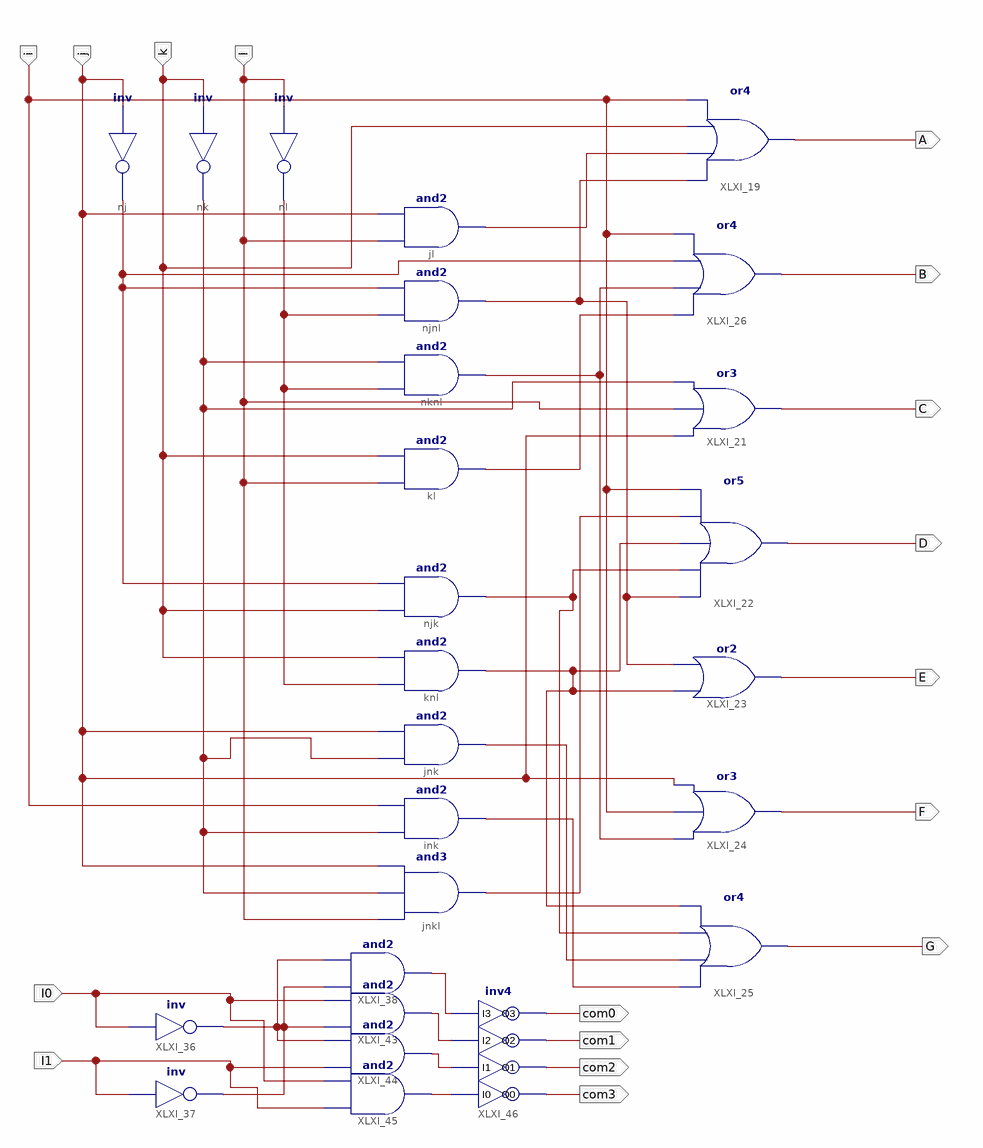
[diagram p0: schematic sheet 1]
// Xilinx ISE schematic BCDto7Seg.sch (spartan6) as structural Verilog: 26 symbols, 17 ports
module BCDto7Seg (
  input  i,
  input  k,
  input  j,
  input  l,
  input  I0,
  input  I1,
  output A,
  output B,
  output C,
  output D,
  output E,
  output F,
  output G,
  output com0,
  output com1,
  output com2,
  output com3
);

  wire XLXN_8, XLXN_52, XLXN_55, XLXN_59, XLXN_62, XLXN_65, XLXN_70, XLXN_77, XLXN_87, XLXN_88, XLXN_89,
       XLXN_90, XLXN_99, XLXN_100, XLXN_125, XLXN_126, XLXN_127, XLXN_128;

  not nj (XLXN_77, j);
  not nk (XLXN_8, k);
  not nl (XLXN_90, l);
  and jl (XLXN_52, l, j);
  and njnl (XLXN_88, XLXN_90, XLXN_77);
  and nknl (XLXN_55, XLXN_90, XLXN_8);
  and njk (XLXN_62, k, XLXN_77);
  and knl (XLXN_65, XLXN_90, k);
  and jnk (XLXN_89, XLXN_8, j);
  and ink (XLXN_70, XLXN_8, i);
  and jnkl (XLXN_59, l, XLXN_8, j);
  or XLXI_19 (A, XLXN_88, XLXN_52, k, i);
  or XLXI_21 (C, j, l, XLXN_8);
  or XLXI_22 (D, XLXN_88, XLXN_62, XLXN_65, XLXN_59, i);
  or XLXI_23 (E, XLXN_65, XLXN_88);
  or XLXI_24 (F, XLXN_55, i, j);
  or XLXI_25 (G, XLXN_70, XLXN_89, XLXN_62, XLXN_65);
  or XLXI_26 (B, XLXN_87, XLXN_55, XLXN_77, i);
  and kl (XLXN_87, l, k);
  not XLXI_36 (XLXN_99, I0);
  not XLXI_37 (XLXN_100, I1);
  and XLXI_38 (XLXN_128, XLXN_100, XLXN_99);
  and XLXI_43 (XLXN_127, XLXN_100, I0);
  and XLXI_44 (XLXN_126, I1, XLXN_99);
  and XLXI_45 (XLXN_125, I1, I0);
  inv4 XLXI_46 (.I0(XLXN_125), .I1(XLXN_126), .I2(XLXN_127), .I3(XLXN_128), .O0(com3), .O1(com2), .O2(com1), .O3(com0));
endmodule
